# Altium project zx-pentagon.PrjPCB
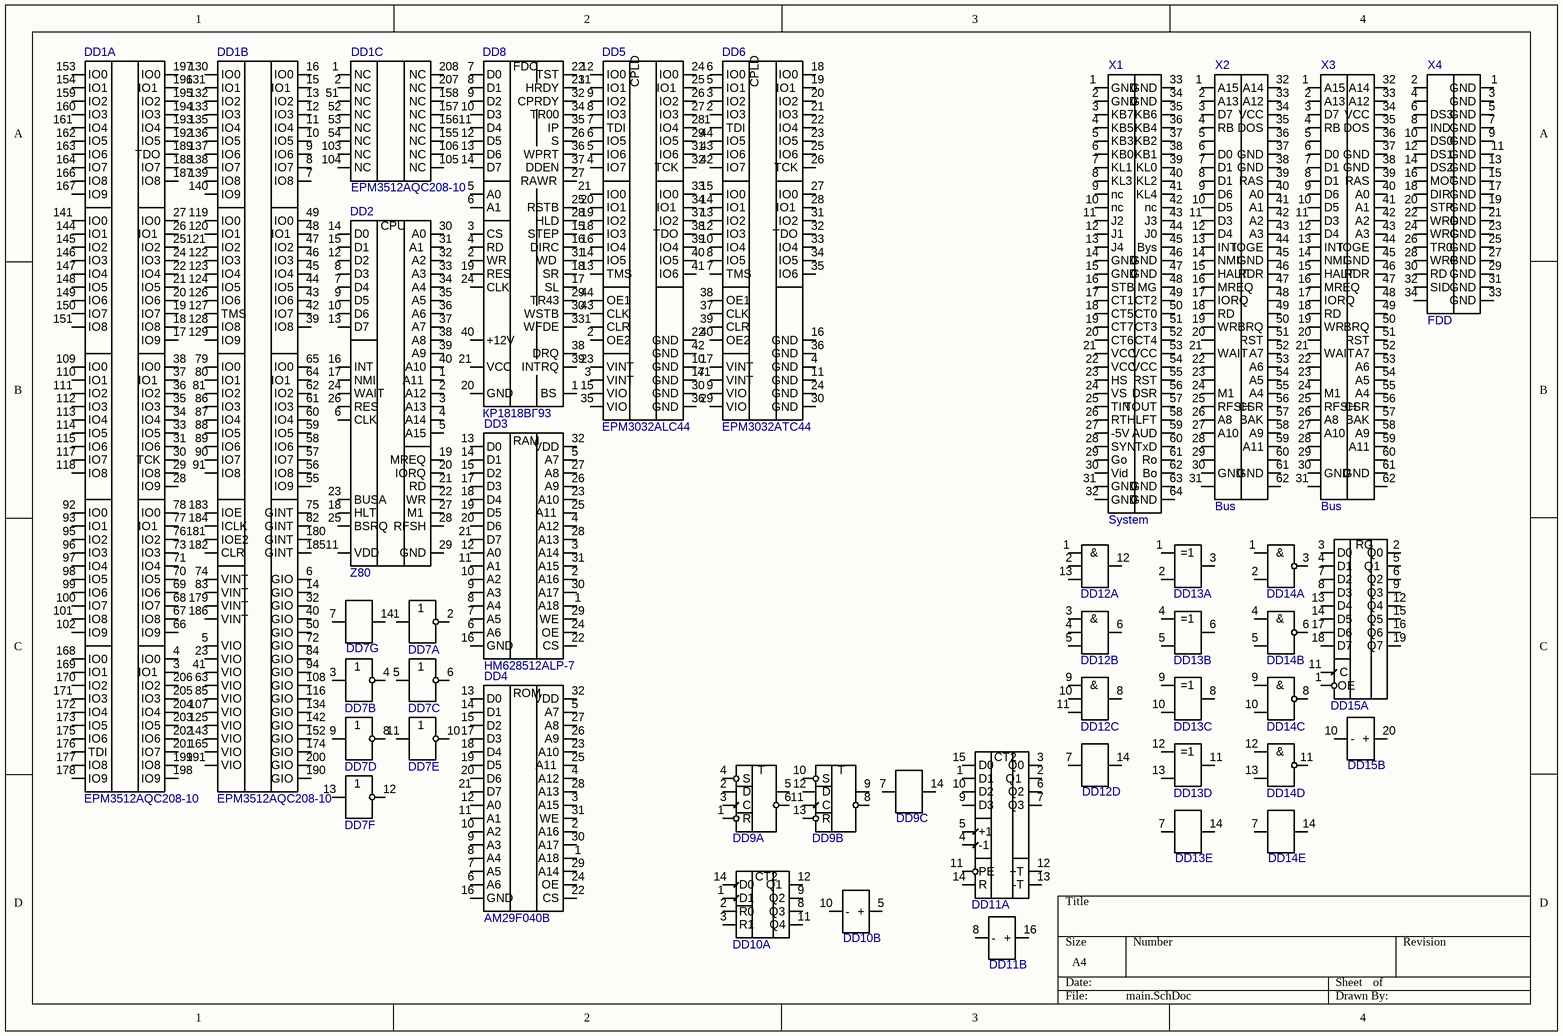
[diagram p0: main.SchDoc]
1 sheet, 19 parts. Net scope: global (net labels, ports and power ports of the same name join across sheets).
Board file: main.PcbDoc

## Sheet main.SchDoc
size A4

### Parts
DD1  EPM3512AQC208-10  [QFP50P3060X3060X409-208N]  (parts A,B,C of 3)
DD2  Z80  [DIP1540W47P254L5320H635Q40B]
DD3  HM628512ALP-7  [DIP254P1524X482-32]
DD4  AM29F040B  [DIP254P1524X482-32]
DD5  EPM3032ALC44  [PLCC-44-R]
DD6  EPM3032ATC44  [QFP80P1200X1200X120-44N]
DD7  КР1533ЛН1  [DIP14]  (value not drawn)  (parts A,B,C,D,E,F,G of 7)
DD8  КР1818ВГ93  [KR1818VG93]
DD9  КР1533ТМ2  [DIP14]  (value not drawn)  (parts A,B,C of 3)
DD10  КР1533ИЕ5  [DIP14]  (value not drawn)  (parts A,B of 2)
DD11  КР1533ИЕ7  [DIP16]  (value not drawn)  (parts A,B of 2)
DD12  КР1533ЛИ3  [DIP14]  (value not drawn)  (parts A,B,C,D of 4)
DD13  КР1533ЛП5  [DIP14]  (value not drawn)  (parts A,B,C,D,E of 5)
DD14  КР1533ЛA3  [DIP14]  (value not drawn)  (parts A,B,C,D,E of 5)
DD15  КР1533ИР23  [DIP20]  (value not drawn)  (parts A,B of 2)
X1  System  [TE_6-1393644-3]
X2  Bus  [SL62]
X3  Bus  [SL62]
X4  FDD  [TE_103309-7]

### Nets

Not connected (* = marked no-connect by the designer): DD1 1(NC) 2(NC) 3(IO1) 4(IO0) 5(VIO) 6(GIO) 7(IO8) 8(IO7) 9(IO6) 10(IO5) 11(IO4) 12(IO3) 13(IO2) 14(GIO) 15(IO1) 16(IO0) 17(IO9) 18(IO8) 19(IO7) 20(IO6) 21(IO5) 22(IO4) 23(VIO) 24(IO3) 25(IO2) 26(IO1) 27(IO0) 28(IO9) 29(IO8) 30(TCK) 31(IO6) 32(GIO) 33(IO5) 34(IO4) 35(IO3) 36(IO2) 37(IO1) 38(IO0) 39(IO8) 40(GIO) 41(VIO) 42(IO7) 43(IO6) 44(IO5) 45(IO4) 46(IO3) 47(IO2) 48(IO1) 49(IO0) 50(GIO) 51(NC) 52(NC) 53(NC) 54(NC) 55(IO9) 56(IO8) 57(IO7) 58(IO6) 59(IO5) 60(IO4) 61(IO3) 62(IO2) 63(VIO) 64(IO1) 65(IO0) 66(IO9) 67(IO8) 68(IO7) 69(IO6) 70(IO5) 71(IO4) 72(GIO) 73(IO3) 74(VINT) 75(GINT) 76(IO2) 77(IO1) 78(IO0) 79(IO0) 80(IO1) 81(IO2) 82(GINT) 83(VINT) 84(GIO) 85(VIO) 86(IO3) 87(IO4) 88(IO5) 89(IO6) 90(IO7) 91(IO8) 92(IO0) 93(IO1) 94(GIO) 95(IO2) 96(IO3) 97(IO4) 98(IO5) 99(IO6) 100(IO7) 101(IO8) 102(IO9) 103(NC) 104(NC) 105(NC) 106(NC) 107(VIO) 108(GIO) 109(IO0) 110(IO1) 111(IO2) 112(IO3) 113(IO4) 114(IO5) 115(IO6) 116(GIO) 117(IO7) 118(IO8) 119(IO0) 120(IO1) 121(IO2) 122(IO3) 123(IO4) 124(IO5) 125(VIO) 126(IO6) 127(TMS) 128(IO8) 129(IO9) 130(IO0) 131(IO1) 132(IO2) 133(IO3) 134(GIO) 135(IO4) 136(IO5) 137(IO6) 138(IO7) 139(IO8) 140(IO9) 141(IO0) 142(GIO) 143(VIO) 144(IO1) 145(IO2) 146(IO3) 147(IO4) 148(IO5) 149(IO6) 150(IO7) 151(IO8) 152(GIO) 153(IO0) 154(IO1) 155(NC) 156(NC) 157(NC) 158(NC) 159(IO2) 160(IO3) 161(IO4) 162(IO5) 163(IO6) 164(IO7) 165(VIO) 166(IO8) 167(IO9) 168(IO0) 169(IO1) 170(IO2) 171(IO3) 172(IO4) 173(IO5) 174(GIO) 175(IO6) 176(TDI) 177(IO8) 178(IO9) 179(VINT) 180(GINT) 181(IOE2) 182(CLR) 183(IOE) 184(ICLK) 185(GINT) 186(VINT) 187(IO8) 188(IO7) 189(TDO) 190(GIO) 191(VIO) 192(IO5) 193(IO4) 194(IO3) 195(IO2) 196(IO1) 197(IO0) 198(IO9) 199(IO8) 200(GIO) 201(IO7) 202(IO6) 203(IO5) 204(IO4) 205(IO3) 206(IO2) 207(NC) 208(NC); DD2 1(A11) 2(A12) 3(A13) 4(A14) 5(A15) 6(CLK) 7(D4) 8(D3) 9(D5) 10(D6) 11(VDD) 12(D2) 13(D7) 14(D0) 15(D1) 16(INT) 17(NMI) 18(HLT) 19(MREQ) 20(IORQ) 21(RD) 22(WR) 23(BUSA) 24(WAIT) 25(BSRQ) 26(RES) 27(M1) 28(RFSH) 29(GND) 30(A0) 31(A1) 32(A2) 33(A3) 34(A4) 35(A5) 36(A6) 37(A7) 38(A8) 39(A9) 40(A10); DD3 1(A18) 2(A16) 3(A14) 4(A12) 5(A7) 6(A6) 7(A5) 8(A4) 9(A3) 10(A2) 11(A1) 12(A0) 13(D0) 14(D1) 15(D2) 16(GND) 17(D3) 18(D4) 19(D5) 20(D6) 21(D7) 22(CS) 23(A10) 24(OE) 25(A11) 26(A9) 27(A8) 28(A13) 29(WE) 30(A17) 31(A15) 32(VDD); DD4 1(A18) 2(A16) 3(A15) 4(A12) 5(A7) 6(A6) 7(A5) 8(A4) 9(A3) 10(A2) 11(A1) 12(A0) 13(D0) 14(D1) 15(D2) 16(GND) 17(D3) 18(D4) 19(D5) 20(D6) 21(D7) 22(CS) 23(A10) 24(OE) 25(A11) 26(A9) 27(A8) 28(A13) 29(A14) 30(A17) 31(WE) 32(VDD); DD5 1(CLR) 2(OE2) 3(VINT) 4(IO7) 5(IO6) 6(IO5) 7(TDI) 8(IO3) 9(IO2) 10(GND) 11(IO1) 12(IO0) 13(TMS) 14(IO5) 15(VIO) 16(IO4) 17(GND) 18(IO3) 19(IO2) 20(IO1) 21(IO0) 22(GND) 23(VINT) 24(IO0) 25(IO1) 26(IO2) 27(IO3) 28(IO4) 29(IO5) 30(GND) 31(IO6) 32(TCK) 33(IO0) 34(IO1) 35(VIO) 36(GND) 37(IO2) 38(TDO) 39(IO4) 40(IO5) 41(IO6) 42(GND) 43(CLK) 44(OE1); DD6 1(TDI) 2(IO3) 3(IO2) 4(GND) 5(IO1) 6(IO0) 7(TMS) 8(IO5) 9(VIO) 10(IO4) 11(GND) 12(IO3) 13(IO2) 14(IO1) 15(IO0) 16(GND) 17(VINT) 18(IO0) 19(IO1) 20(IO2) 21(IO3) 22(IO4) 23(IO5) 24(GND) 25(IO6) 26(TCK) 27(IO0) 28(IO1) 29(VIO) 30(GND) 31(IO2) 32(TDO) 33(IO4) 34(IO5) 35(IO6) 36(GND) 37(CLK) 38(OE1) 39(CLR) 40(OE2) 41(VINT) 42(IO7) 43(IO6) 44(IO5); DD7 1 2 3 4 5 6 7(GND) 8 9 10 11 12 13 14(VCC); DD8 1(BS) 2(WR) 3(CS) 4(RD) 5(A0) 6(A1) 7(D0) 8(D1) 9(D2) 10(D3) 11(D4) 12(D5) 13(D6) 14(D7) 15(STEP) 16(DIRC) 17(SL) 18(SR) 19(RES) 20(GND) 21(VCC) 22(TST) 23(HRDY) 24(CLK) 25(RSTB) 26(S) 27(RAWR) 28(HLD) 29(TR43) 30(WSTB) 31(WD) 32(CPRDY) 33(WFDE) 34(TR00) 35(IP) 36(WPRT) 37(DDEN) 38(DRQ) 39(INTRQ) 40(+12V); DD9 1(R) 2(D) 3(C) 4(S) 5 6 7(GND) 8 9 10(S) 11(C) 12(D) 13(R) 14(VCC); DD10 1(D1) 2(R0) 3(R1) 5(+) 8(Q3) 9(Q2) 10(-) 11(Q4) 12(Q1) 14(D0); DD11 1(D1) 2(Q1) 3(Q0) 4(-1) 5(+1) 6(Q2) 7(Q3) 8(-) 9(D3) 10(D2) 11(PE) 12(+T) 13(-T) 14(R) 15(D0) 16(+); DD12 1 2 3 4 5 6 7(GND) 8 9 10 11 12 13 14(VCC); DD13 1 2 3 4 5 6 7(GND) 8 9 10 11 12 13 14(VCC); DD14 1 2 3 4 5 6 7(GND) 8 9 10 11 12 13 14(VCC); DD15 1(OE) 2(Q0) 3(D0) 4(D1) 5(Q1) 6(Q2) 7(D2) 8(D3) 9(Q3) 10(-) 11(C) 12(Q4) 13(D4) 14(D5) 15(Q5) 16(Q6) 17(D6) 18(D7) 19(Q7) 20(+); X1 1(GND) 2(GND) 3(KB7) 4(KB5) 5(KB3) 6(KB0) 7(KL1) 8(KL3) 9(nc) 10(nc) 11(J2) 12(J1) 13(J4) 14(GND) 15(GND) 16(STB) 17(CT1) 18(CT5) 19(CT7) 20(CT6) 21(VCC) 22(VCC) 23(HS) 24(VS) 25(TIN) 26(RTH) 27(-5V) 28(SYN) 29(Go) 30(Vid) 31(GND) 32(GND) 33(GND) 34(GND) 35(KB6) 36(KB4) 37(KB2) 38(KB1) 39(KL0) 40(KL2) 41(KL4) 42(nc) 43(J3) 44(J0) 45(Bys) 46(GND) 47(GND) 48(MG) 49(CT2) 50(CT0) 51(CT3) 52(CT4) 53(VCC) 54(VCC) 55(RST) 56(DSR) 57(TOUT) 58(LFT) 59(AUD) 60(TxD) 61(Ro) 62(Bo) 63(GND) 64(GND); X2 1(A15) 2(A13) 3(D7) 4(RB) 5 6(D0) 7(D1) 8(D1) 9(D6) 10(D5) 11(D3) 12(D4) 13(INT) 14(NMI) 15(HALT) 16(MREQ) 17(IORQ) 18(RD) 19(WR) 20 21(WAIT) 22 23 24(M1) 25(RFSH) 26(A8) 27(A10) 28 29 30(GND) 31 32(A14) 33(A12) 34(VCC) 35(DOS) 36 37(GND) 38(GND) 39(RAS) 40(A0) 41(A1) 42(A2) 43(A3) 44(IOGE) 45(GND) 46(RDR) 47 48 49 50(BRQ) 51(RST) 52(A7) 53(A6) 54(A5) 55(A4) 56(CSR) 57(BAK) 58(A9) 59(A11) 60 61(GND) 62; X3 1(A15) 2(A13) 3(D7) 4(RB) 5 6(D0) 7(D1) 8(D1) 9(D6) 10(D5) 11(D3) 12(D4) 13(INT) 14(NMI) 15(HALT) 16(MREQ) 17(IORQ) 18(RD) 19(WR) 20 21(WAIT) 22 23 24(M1) 25(RFSH) 26(A8) 27(A10) 28 29 30(GND) 31 32(A14) 33(A12) 34(VCC) 35(DOS) 36 37(GND) 38(GND) 39(RAS) 40(A0) 41(A1) 42(A2) 43(A3) 44(IOGE) 45(GND) 46(RDR) 47 48 49 50(BRQ) 51(RST) 52(A7) 53(A6) 54(A5) 55(A4) 56(CSR) 57(BAK) 58(A9) 59(A11) 60 61(GND) 62; X4 1(GND) 2 3(GND) 4 5(GND) 6(DS3) 7(GND) 8(IND) 9(GND) 10(DS0) 11(GND) 12(DS1) 13(GND) 14(DS2) 15(GND) 16(MOT) 17(GND) 18(DIR) 19(GND) 20(STP) 21(GND) 22(WRD) 23(GND) 24(WRG) 25(GND) 26(TR0) 27(GND) 28(WRP) 29(GND) 30(RD) 31(GND) 32(SID) 33(GND) 34

### Notes on the sheet
- (in symbol AM29F040B) ROM
- (in symbol EPM3032ALC44) CPLD
- (in symbol EPM3032ATC44) CPLD
- (in symbol HM628512ALP-7) RAM
- (in symbol Z80) CPU
- (in symbol КР1533ИЕ5, part A) CT2
- (in symbol КР1533ИЕ7, part A) CT2
- (in symbol КР1533ИР23, part A) RG
- (in symbol КР1533ЛA3, part A) &
- (in symbol КР1533ЛA3, part B) &
- (in symbol КР1533ЛA3, part C) &
- (in symbol КР1533ЛA3, part D) &
- (in symbol КР1533ЛИ3, part A) &
- (in symbol КР1533ЛИ3, part B) &
- (in symbol КР1533ЛИ3, part C) &
- (in symbol КР1533ТМ2, part A) Т
- (in symbol КР1533ТМ2, part B) Т
- (in symbol КР1818ВГ93) FDC

### Library data of the parts
DD3 = HM628512ALP-7: 512Kx8 Static RAM
DD5 = EPM3032ALC44: 44-Pin PLCC44
DD6 = EPM3032ATC44: 44-Pin TQFP